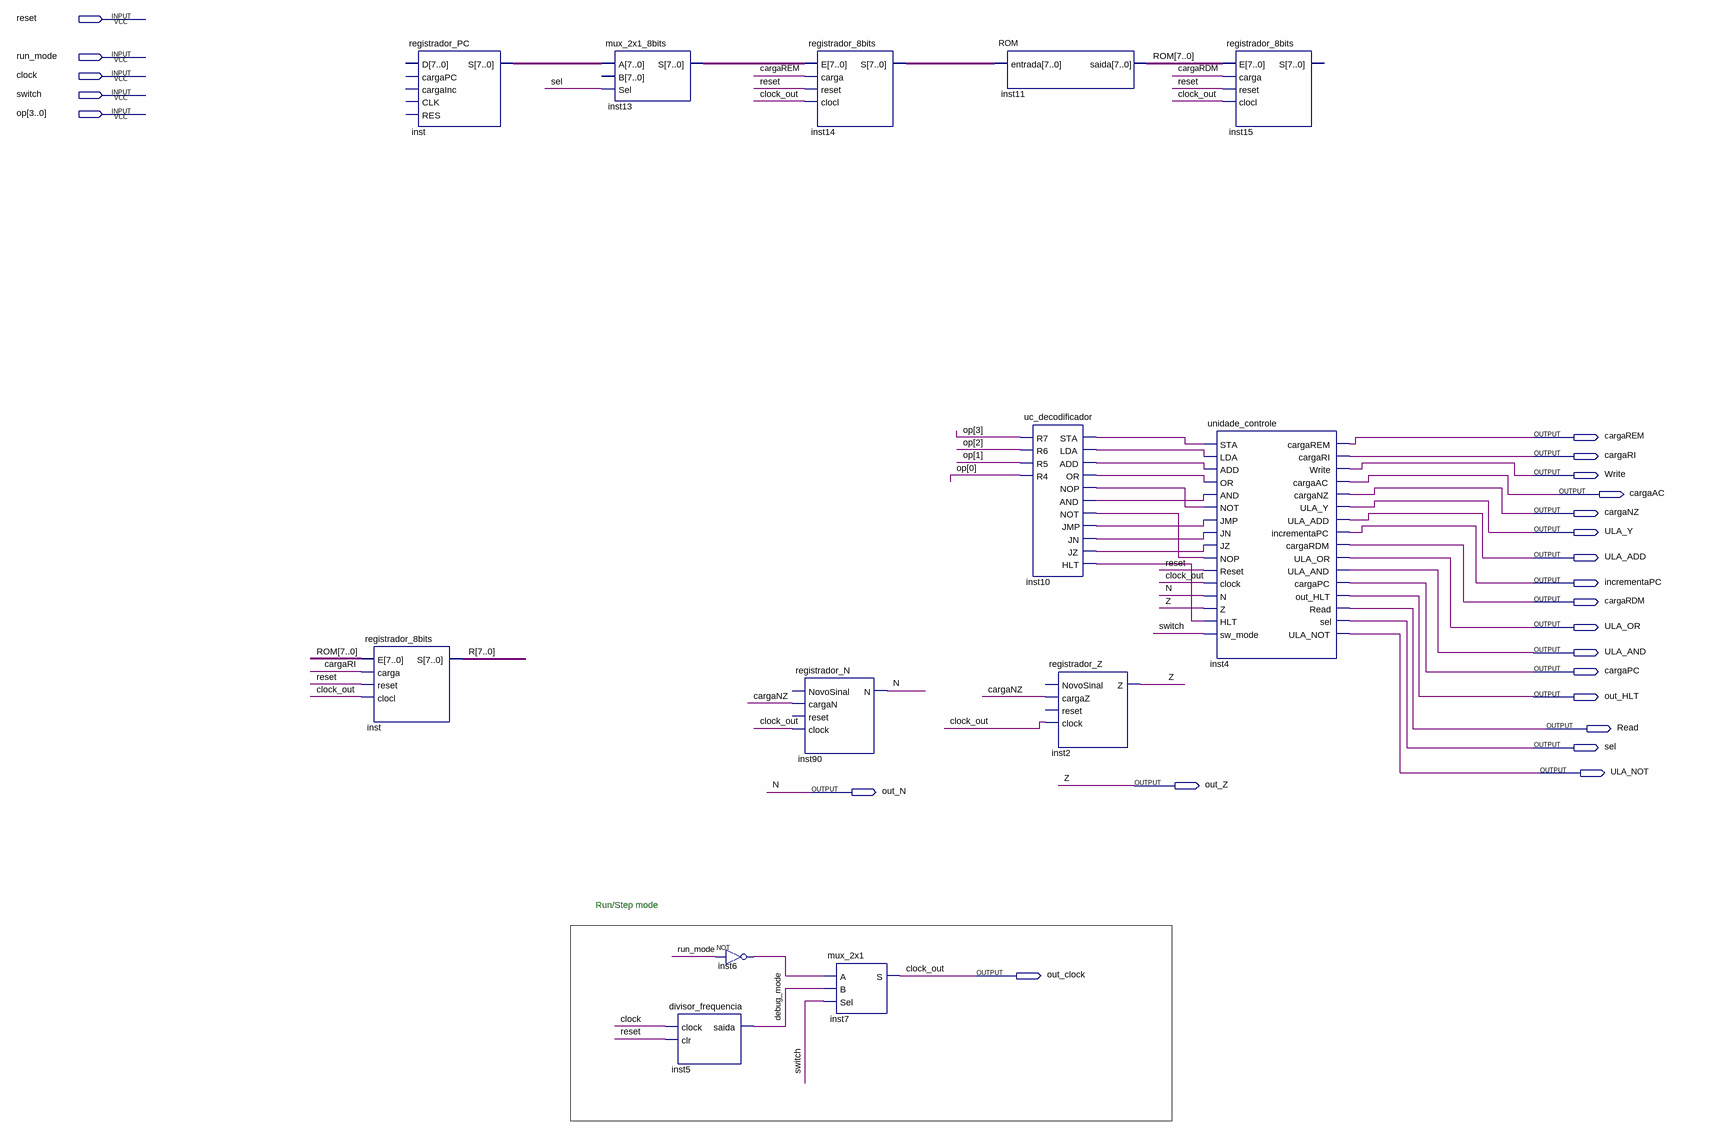
[diagram p0: schematic sheet]
// Quartus schematic Neander.bdf as structural Verilog: 13 symbols, 24 pins
module Neander (
  input  reset,
  input  run_mode,
  input  clock,
  input  switch,
  input  [3:0] op,
  output cargaREM,
  output cargaRI,
  output Write,
  output cargaAC,
  output cargaNZ,
  output ULA_Y,
  output ULA_ADD,
  output incrementaPC,
  output cargaRDM,
  output ULA_OR,
  output ULA_AND,
  output cargaPC,
  output out_HLT,
  output Read,
  output sel,
  output ULA_NOT,
  output out_Z,
  output out_N,
  output out_clock
);

  wire debug_mode, inst6_out, inst10_add, inst10_and, inst10_hlt, inst10_jmp, inst10_jn, inst10_jz,
       inst10_lda, inst10_nop, inst10_not, inst10_or, inst10_sta;
  wire [7:0] inst13_s, inst14_s, inst_s, R, ROM;

  registrador_8bits inst (.E(ROM), .carga(cargaRI), .reset(reset), .clocl(out_clock), .S(R));
  registrador_PC inst_dup2 (.S(inst_s));  // open: D, cargaPC, cargaInc, CLK, RES
  mux_2x1_8bits inst13 (.A(inst_s), .Sel(sel), .S(inst13_s));  // open: B
  divisor_frequencia inst5 (.clock(clock), .clr(reset), .saida(debug_mode));
  not inst6 (inst6_out, run_mode);
  registrador_8bits inst14 (.E(inst13_s), .carga(cargaREM), .reset(reset), .clocl(out_clock), .S(inst14_s));
  registrador_N inst90 (.cargaN(cargaNZ), .clock(out_clock), .N(out_N));  // open: NovoSinal, reset
  mux_2x1 inst7 (.A(inst6_out), .B(debug_mode), .Sel(switch), .S(out_clock));
  ROM inst11 (.entrada(inst14_s), .saida(ROM));
  uc_decodificador inst10 (
    .R7(op[3]), .R6(op[2]), .R5(op[1]), .R4(op[0]), .STA(inst10_sta), .LDA(inst10_lda), .ADD(inst10_add),
    .OR(inst10_or), .NOP(inst10_nop), .AND(inst10_and), .NOT(inst10_not), .JMP(inst10_jmp), .JN(inst10_jn),
    .JZ(inst10_jz), .HLT(inst10_hlt));
  registrador_Z inst2 (.cargaZ(cargaNZ), .clock(out_clock), .Z(out_Z));  // open: NovoSinal, reset
  registrador_8bits inst15 (.E(ROM), .carga(cargaRDM), .reset(reset), .clocl(out_clock));  // open: S
  unidade_controle inst4 (
    .STA(inst10_sta), .LDA(inst10_lda), .ADD(inst10_add), .OR(inst10_or), .AND(inst10_and), .NOT(inst10_nop),
    .JMP(inst10_jmp), .JN(inst10_jn), .JZ(inst10_jz), .NOP(inst10_not), .Reset(reset), .clock(out_clock),
    .N(out_N), .Z(out_Z), .HLT(inst10_hlt), .sw_mode(switch), .cargaREM(cargaREM), .cargaRI(cargaRI),
    .Write(Write), .cargaAC(cargaAC), .cargaNZ(cargaNZ), .ULA_Y(ULA_Y), .ULA_ADD(ULA_ADD),
    .incrementaPC(incrementaPC), .cargaRDM(cargaRDM), .ULA_OR(ULA_OR), .ULA_AND(ULA_AND), .cargaPC(cargaPC),
    .out_HLT(out_HLT), .Read(Read), .sel(sel), .ULA_NOT(ULA_NOT));

  // Other names for the same wires on the sheet: clock_out = out_clock; N = out_N; Z = out_Z

  // Notes on the sheet:
  //   Run/Step mode
endmodule
